# EAGLE design HyperDriver (EAGLE 9.2.0)
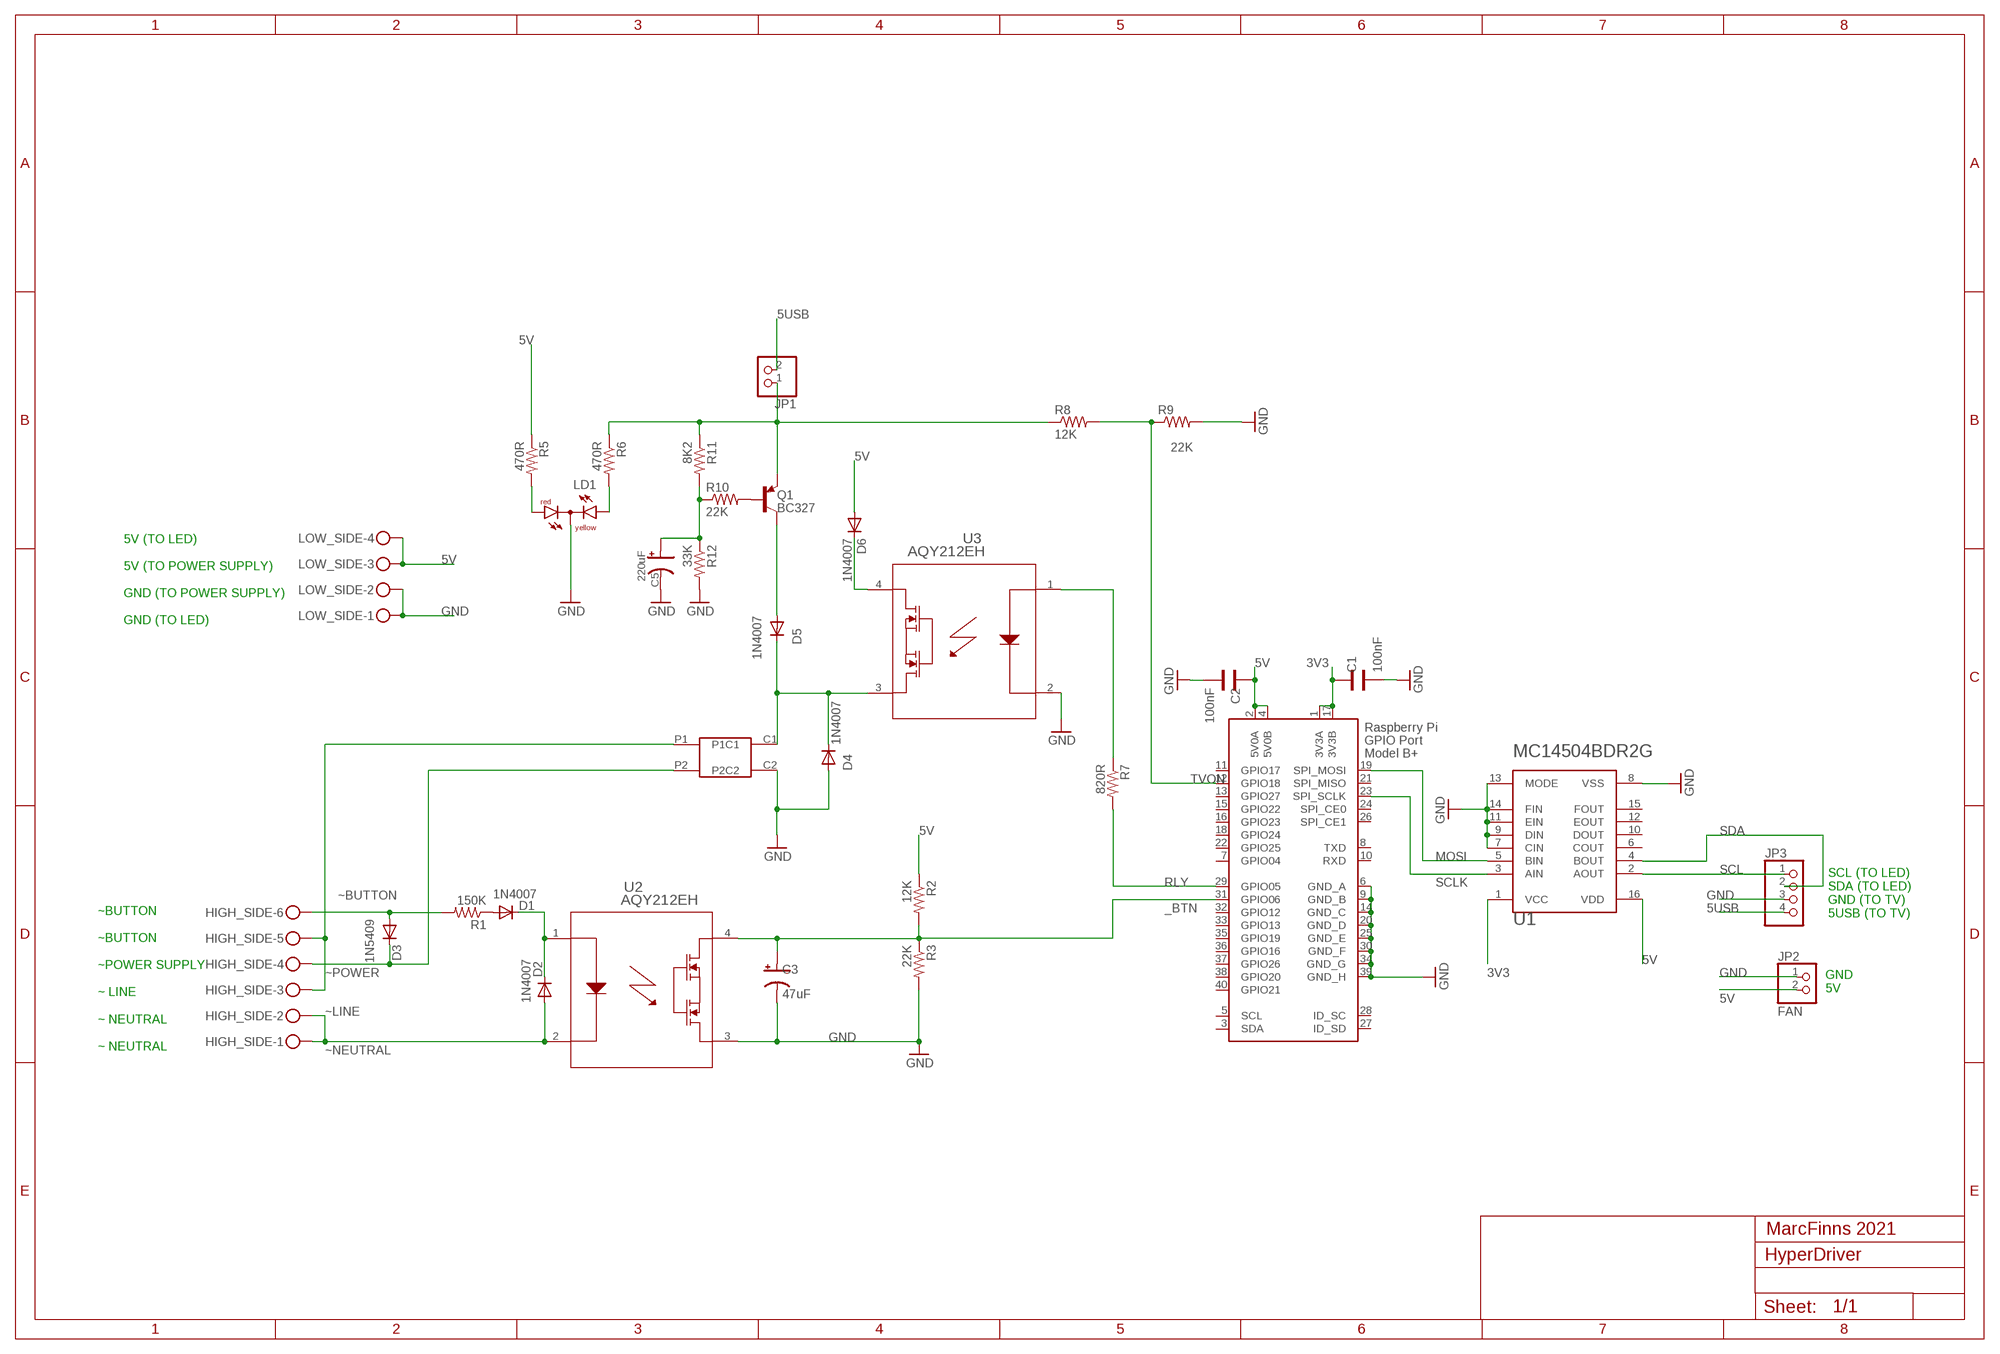
[diagram p0: schematic, sheet 1]

## Parts
C1  100nF  CAP055X070  [CAP-055X070]
C2  100nF  CAP055X070  [CAP-055X070]
C3  47uF  CAP-POL025X50  [CAP-POL-025X50]
C5  220uF  CAP-POLE3,5-8  [CAP-POL-E3,5-8]
D1  1N4007  1N4004  [DO41-10]
D2  1N4007  1N4004  [DO41-10]
D3  1N5409  1N5400  [DO201-15]
D4  1N4007  1N4004  [DO41-10]
D5  1N4007  1N4004  [DO41-10]
D6  1N4007  1N4004  [DO41-10]
G5NB_RELAY1  OMRON_G5NB_RELAY  [G5NB_RELAY]
HIGH_SIDE  MKDSN1,5/6-5,08  [MKDSN1,5/6-5,08]
JP1  PINHD-1X2  [1X02]
JP2  FAN  PINHD-1X2  [1X02]
JP3  PINHD-1X4  [1X04]
LD1  DUOLED-RY-C  [DUOLED-C-5MM]
LOW_SIDE  MKDSN1,5/4-5,08  [MKDSN1,5/4-5,08]
Q1  BC327  [TO92]
R1  150K  R-US_0207/9  [0207/9]
R2  12K  R-US_0207/9  [0207/9]
R3  22K  R-US_0207/9  [0207/9]
R5  470R  R-US_0207/9  [0207/9]
R6  470R  R-US_0207/9  [0207/9]
R7  820R  R-US_0207/9  [0207/9]
R8  12K  R-US_0207/9  [0207/9]
R9  22K  R-US_0207/9  [0207/9]
R10  22K  R-US_0207/9  [0207/9]
R11  8K2  R-US_0207/9  [0207/9]
R12  33K  R-US_0207/9  [0207/9]
U1  ON_SEMICONDUCTOR_MC14504BDR2GON_SEMICONDUCTOR_MC14504BDR2G_0_1  [ON_SEMICONDUCTOR_MC14504BDR2G_1]
U2  AQY212EH  [PAN_AQY21-DIP4_PAN]
U3  AQY212EH  [PAN_AQY21-DIP4_PAN]
X1  RASPI_GPIO_B+#_PIN  [RASPI_GPIO_B+_PIN]

## Nets
3V3: C1.1 U1.1(VCC) X1.1(3V3A) X1.17(3V3B)
5USB: JP1.2 JP3.4
5V: C2.1 D6.A JP2.2 LOW_SIDE.3 LOW_SIDE.4 R2.1 R5.1 U1.16(VDD) X1.2(5V0A) X1.4(5V0B)
_BTN: C3.A R2.2 R3.1 U2.4 X1.31(GPIO06)
GND: C1.2 C2.2 C3.C C5.C D4.A G5NB_RELAY1.C2 JP2.1 JP3.3 LD1.C LOW_SIDE.1 LOW_SIDE.2 R3.2 R9.2 R12.2 U1.7(CIN) U1.8(VSS) U1.9(DIN) U1.11(EIN) U1.13(MODE) U1.14(FIN) U2.3 U3.2 X1.6(GND_A) X1.9(GND_B) X1.14(GND_C) X1.20(GND_D) X1.25(GND_E) X1.30(GND_F) X1.34(GND_G) X1.39(GND_H)
J_5USB: JP1.1 Q1.1(E) R6.1 R8.1 R11.1
MOSI: U1.5(BIN) X1.19(SPI_MOSI)
N$1: LD1.AR R5.2
N$3: LD1.AX(AY) R6.2
N$4: D6.C U3.4
N$5: Q1.2(B) R10.2
N$6: C5.A R10.1 R11.2 R12.1
N$7: D1.C D2.C U2.1
N$8: R7.1 U3.1
N$9: D4.C D5.C G5NB_RELAY1.C1 U3.3
N$10: D5.A Q1.3(C)
N$11: D1.A R1.1
RLY: R7.2 X1.29(GPIO05)
SCL: JP3.1 U1.2(AOUT)
SCLK: U1.3(AIN) X1.23(SPI_SCLK)
SDA: JP3.2 U1.4(BOUT)
TVON: R8.2 R9.1 X1.12(GPIO18)
~BUTTON: D3.A HIGH_SIDE.6 R1.2
~LINE: G5NB_RELAY1.P1 HIGH_SIDE.3 HIGH_SIDE.5
~NEUTRAL: D2.A HIGH_SIDE.1 HIGH_SIDE.2 U2.2
~POWER: D3.C G5NB_RELAY1.P2 HIGH_SIDE.4
Unconnected: U1.6(COUT) U1.10(DOUT) U1.12(EOUT) U1.15(FOUT) X1.3(SDA) X1.5(SCL) X1.7(GPIO04) X1.8(TXD) X1.10(RXD) X1.11(GPIO17) X1.13(GPIO27) X1.15(GPIO22) X1.16(GPIO23) X1.18(GPIO24) X1.21(SPI_MISO) X1.22(GPIO25) X1.24(SPI_CE0) X1.26(SPI_CE1) X1.27(ID_SD) X1.28(ID_SC) X1.32(GPIO12) X1.33(GPIO13) X1.35(GPIO19) X1.36(GPIO16) X1.37(GPIO26) X1.38(GPIO20) X1.40(GPIO21)

## Notes on the sheet
- 5V (TO LED)
  
  5V (TO POWER SUPPLY)
  
  GND (TO POWER SUPPLY)
  
  GND (TO LED)
- SCL (TO LED)
  SDA (TO LED)
  GND (TO TV)
  5USB (TO TV)
- GND
  5V
- ~BUTTON
  
  ~BUTTON
  
  ~POWER SUPPLY
  
  ~ LINE
  
  ~ NEUTRAL
  
  ~ NEUTRAL
- MarcFinns 2021

## Library data of the parts
C1 C2 = Ai_Passives:CAP
C3 C5 = Ai_Passives:CAP-POL
D1 D2 D4-D6 = adafruit:1N4004: DIODE General purpose 1N400x type rectifier (With bigger pads) http://www.ladyada.net/library/pcb/eaglelibrary.html
D3 = diode:1N5400: DIODE standard rectifier, 3 A, 50 V (Motorola)
G5NB_RELAY1 = Omron G5NB Relay:OMRON_G5NB_RELAY
HIGH_SIDE = con-phoenix-508:MKDSN1,5/6-5,08: MKDSN 1,5/ 6-5,08 Printklemme Nennstrom: 13,5 A Nennspannung: 250 V Rastermaß: 5,08 mm Polzahl: 6 Anschlussart: Schraubanschluss Montage: Löten Anschlussrichtung Leiter/Platine: 0 ° Artikelnummer: 1729160 Source: http://eshop.phoenixcontact.com .. 1729160.pdf
JP1 JP2 = pinhead:PINHD-1X2: PIN HEADER
JP3 = pinhead:PINHD-1X4: PIN HEADER
LD1 = led:DUOLED-RY-C: DUO LED 2 colors (red/yellow), 5 mm, round, common Cathode www.ligitek.com or other producers.
LOW_SIDE = con-phoenix-508:MKDSN1,5/4-5,08: MKDSN 1,5/ 4-5,08 Printklemme Nennstrom: 13,5 A Nennspannung: 250 V Rastermaß: 5,08 mm Polzahl: 4 Anschlussart: Schraubanschluss Montage: Löten Anschlussrichtung Leiter/Platine: 0 ° Artikelnummer: 1729144 Source: http://eshop.phoenixcontact.com .. 1729144.pdf
Q1 = transistor-pnp:BC327: PNP Transistor
R1-R3 R5-R12 = adafruit:R-US_: RESISTOR, American symbol
U1 = ON Semiconductor - MC14504BDR2G:ON_SEMICONDUCTOR_MC14504BDR2G: Voltage Level Translator Unidirectional 1 Circuit 6 Channel 16-SOIC; AMBIENT_TEMPERATURE_RANGE_HIGH: +125°C; AMBIENT_TEMPERATURE_RANGE_LOW: -55°C; AUTOMOTIVE: No; CENTROID_NOT_SPECIFIED: No; DATASHEET: https://www.onsemi.com/pub/Collateral/MC14504B-D.PDF; DEVICE_CLASS_L1: Integrated Circuits (ICs); DEVICE_CLASS_L2: Logic ICs; DEVICE_CLASS_L3: Voltage Level Shifters; DIGIKEY_DESCRIPTION: IC TRNSLTR UNIDIRECTIONAL 16SOIC; DIGIKEY_PART_NUMBER: MC14504BDR2GOSCT-ND; FOOTPRINT_PARAMETERS_1: {"fp_type":"SOIC_narrow","params":{"N":{"nom":16,"long name":"Number of leads","min":null,"max":null,"short name":"N","type":"count"},"A":{"nom":false,"long name":"Height","min":1350000,"max":1750000,"short name":"A","type":"measurement"},"A1":{"nom":false,"long name":"Package clearance","min":100000,"max":250000,"short name":"A1","type":"measurement"},"A2":{"nom":false,"long name":"Package height","min":1100000,"max":1650000,"short name":"A2","type":"measurement"},"D":{"nom":false,"long name":"Package length","min":9800000,"max":10000000,"short name":"D","type":"measurement"},"E":{"nom":false,"long name":"Width w/ leads","min":5800000,"max":6200000,"short name":"E","type":"measurement"},"E1":{"nom":false,"long name":"Package width","min":3800000,"max":4000000,"short name":"E1","type":"measurement"},"B":{"nom":false,"long name":"Lead width","min":350000,"max":490000,"short name":"B","type":"measurement"},"C":{"nom":false,"long name":"Lead thickness","min":190000,"max":250000,"short name":"C","type":"measurement"},"e":{"nom":1270000,"long name":"Lead pitch","min":null,"max":null,"short name":"e","type":"measurement"},"L":{"nom":false,"long name":"Lead foot length","min":400000,"max":1250000,"short name":"L","type":"measurement"},"PHI":{"nom":false,"long name":"Lead foot angle","min":0,"max":7000000,"short name":"PHI","type":"measurement"},"HT":{"default":"No","long name":"Thermal pad","type":"multichoiceparent","short name":"HT","children":[]},"offset x":{"nom":0,"long name":"X Center offset","min":null,"max":null,"short name":"offset x","type":"measurement"},"offset y":{"nom":0,"long name":"Y Center offset","min":null,"max":null,"short name":"offset y","type":"measurement"},"LS":{"default":"Rounded rectangle","long name":"Land shape","type":"multichoice","short name":"LS"},"LS1":{"default":"Rectangle","long name":"Land shape (Pin 1)","type":"multichoice","short name":"LS1"},"solder toe":{"nom":550000,"long name":"Solder fillet (toe)","min":null,"max":null,"short name":"solder toe","type":"fixedmeasurement"},"solder heel":{"nom":450000,"long name":"Solder fillet (heel)","min":null,"max":null,"short name":"solder heel","type":"fixedmeasurement"},"solder side":{"nom":50000,"long name":"Solder fillet (side)","min":null,"max":null,"short name":"solder side","type":"fixedmeasurement"},"courtyard":{"nom":500000,"long name":"Courtyard","min":null,"max":null,"short name":"courtyard","type":"fixedmeasurement"},"SF":{"default":"A","long name":"Packing level","type":"multichoiceparent","short name":"SF","help":"http://support.upverter.com/customer/portal/articles/978783-what-is-a-footprint-packing-level","children":["solder toe","solder heel","solder side","courtyard"]}}}; FOOTPRINT_PARAMETERS_2: {"fp_type":"SOIC_narrow","params":{"N":{"nom":16,"long name":"Number of leads","min":null,"max":null,"short name":"N","type":"count"},"A":{"nom":false,"long name":"Height","min":1350000,"max":1750000,"short name":"A","type":"measurement"},"A1":{"nom":false,"long name":"Package clearance","min":100000,"max":250000,"short name":"A1","type":"measurement"},"A2":{"nom":false,"long name":"Package height","min":1100000,"max":1650000,"short name":"A2","type":"measurement"},"D":{"nom":false,"long name":"Package length","min":9800000,"max":10000000,"short name":"D","type":"measurement"},"E":{"nom":false,"long name":"Width w/ leads","min":5800000,"max":6200000,"short name":"E","type":"measurement"},"E1":{"nom":false,"long name":"Package width","min":3800000,"max":4000000,"short name":"E1","type":"measurement"},"B":{"nom":false,"long name":"Lead width","min":350000,"max":490000,"short name":"B","type":"measurement"},"C":{"nom":false,"long name":"Lead thickness","min":190000,"max":250000,"short name":"C","type":"measurement"},"e":{"nom":1270000,"long name":"Lead pitch","min":null,"max":null,"short name":"e","type":"measurement"},"L":{"nom":false,"long name":"Lead foot length","min":400000,"max":1250000,"short name":"L","type":"measurement"},"PHI":{"nom":false,"long name":"Lead foot angle","min":0,"max":7000000,"short name":"PHI","type":"measurement"},"HT":{"default":"No","long name":"Thermal pad","type":"multichoiceparent","short name":"HT","children":[]},"offset x":{"nom":0,"long name":"X Center offset","min":null,"max":null,"short name":"offset x","type":"measurement"},"offset y":{"nom":0,"long name":"Y Center offset","min":null,"max":null,"short name":"offset y","type":"measurement"},"LS":{"default":"Rounded rectangle","long name":"Land shape","type":"multichoice","short name":"LS"},"LS1":{"default":"Rectangle","long name":"Land shape (Pin 1)","type":"multichoice","short name":"LS1"},"solder toe":{"nom":350000,"long name":"Solder fillet (toe)","min":null,"max":null,"short name":"solder toe","type":"fixedmeasurement"},"solder heel":{"nom":350000,"long name":"Solder fillet (heel)","min":null,"max":null,"short name":"solder heel","type":"fixedmeasurement"},"solder side":{"nom":30000,"long name":"Solder fillet (side)","min":null,"max":null,"short name":"solder side","type":"fixedmeasurement"},"courtyard":{"nom":250000,"long name":"Courtyard","min":null,"max":null,"short name":"courtyard","type":"fixedmeasurement"},"SF":{"default":"B","long name":"Packing level","type":"multichoiceparent","short name":"SF","help":"http://support.upverter.com/customer/portal/articles/978783-what-is-a-footprint-packing-level","children":["solder toe","solder heel","solder side","courtyard"]}}}; FOOTPRINT_PARAMETERS_3: {"fp_type":"SOIC_narrow","params":{"N":{"nom":16,"long name":"Number of leads","min":null,"max":null,"short name":"N","type":"count"},"A":{"nom":false,"long name":"Height","min":1350000,"max":1750000,"short name":"A","type":"measurement"},"A1":{"nom":false,"long name":"Package clearance","min":100000,"max":250000,"short name":"A1","type":"measurement"},"A2":{"nom":false,"long name":"Package height","min":1100000,"max":1650000,"short name":"A2","type":"measurement"},"D":{"nom":false,"long name":"Package length","min":9800000,"max":10000000,"short name":"D","type":"measurement"},"E":{"nom":false,"long name":"Width w/ leads","min":5800000,"max":6200000,"short name":"E","type":"measurement"},"E1":{"nom":false,"long name":"Package width","min":3800000,"max":4000000,"short name":"E1","type":"measurement"},"B":{"nom":false,"long name":"Lead width","min":350000,"max":490000,"short name":"B","type":"measurement"},"C":{"nom":false,"long name":"Lead thickness","min":190000,"max":250000,"short name":"C","type":"measurement"},"e":{"nom":1270000,"long name":"Lead pitch","min":null,"max":null,"short name":"e","type":"measurement"},"L":{"nom":false,"long name":"Lead foot length","min":400000,"max":1250000,"short name":"L","type":"measurement"},"PHI":{"nom":false,"long name":"Lead foot angle","min":0,"max":7000000,"short name":"PHI","type":"measurement"},"HT":{"default":"No","long name":"Thermal pad","type":"multichoiceparent","short name":"HT","children":[]},"offset x":{"nom":0,"long name":"X Center offset","min":null,"max":null,"short name":"offset x","type":"measurement"},"offset y":{"nom":0,"long name":"Y Center offset","min":null,"max":null,"short name":"offset y","type":"measurement"},"LS":{"default":"Rounded rectangle","long name":"Land shape","type":"multichoice","short name":"LS"},"LS1":{"default":"Rectangle","long name":"Land shape (Pin 1)","type":"multichoice","short name":"LS1"},"solder toe":{"nom":150000,"long name":"Solder fillet (toe)","min":null,"max":null,"short name":"solder toe","type":"fixedmeasurement"},"solder heel":{"nom":250000,"long name":"Solder fillet (heel)","min":null,"max":null,"short name":"solder heel","type":"fixedmeasurement"},"solder side":{"nom":10000,"long name":"Solder fillet (side)","min":null,"max":null,"short name":"solder side","type":"fixedmeasurement"},"courtyard":{"nom":100000,"long name":"Courtyard","min":null,"max":null,"short name":"courtyard","type":"fixedmeasurement"},"SF":{"default":"C","long name":"Packing level","type":"multichoiceparent","short name":"SF","help":"http://support.upverter.com/customer/portal/articles/978783-what-is-a-footprint-packing-level","children":["solder toe","solder heel","solder side","courtyard"]}}}; FOOTPRINT_URL: https://www.onsemi.com/pub/Collateral/751B-05.PDF; FOOTPRINT_VARIANT_NAME_0: Recommended_Land_Pattern; FOOTPRINT_VARIANT_NAME_1: IPC_A; FOOTPRINT_VARIANT_NAME_2: IPC_B; FOOTPRINT_VARIANT_NAME_3: IPC_C; HEIGHT: 1.75mm; IPC_LAND_PATTERN_NAME: SOIC127P600X155-16; LEAD_FREE: Yes; LOGIC_FUNCTION_DESC: Non-Inverting; MAX_SUPPLY_VOLTAGE: 18V; MF: ON Semiconductor; MFG_PACKAGE_IDENT: 751B-05; MFG_PACKAGE_IDENT_DATE: 12/2006; MFG_PACKAGE_IDENT_REV: K; MIN_SUPPLY_VOLTAGE: 3V; MOUSER_DESCRIPTION: Voltage Level Shifter CMOS/TTL to CMOS 6 Unidirectional Automotive 16-Pin SOIC T/R; MOUSER_PART_NUMBER: 863-MC14504BDR2G; MPN: MC14504BDR2G; NUMBER_OF_CIRCUITS: 6; NUMBER_OF_INPUTS: 1; NUMBER_OF_OUTPUTS: 1; NUM_PINS: 16; OCTOPART_PART_NUMBER: a116681b6feb7ed1; PACKAGE: SOIC16; PREFIX: U; PROPAGATION_DELAY: 175ns; QUIESCENT_CURRENT: 0.0005-2500uA; ROHS: Yes; STANDOFF_HEIGHT: 0.25mm; SYMBOL_0_0: Standard; TYPE: integrated circuit; VERIFICATION_VERSION: 0.0.0.3; V_A_MAX: 18V; V_A_MIN: 3V; V_B_MAX: 18V; V_B_MIN: 3V
U2 U3 = AQY21-DIP:AQY212EH; BUILT_BY: EMA_UL_Team; MANUFACTURER_PART_NUMBER: AQY212EH; SOURCELIBRARY: Panasonic_2014-11-06; VENDOR: Panasonic
X1 = raspberrypi_bastelstube_v13:RASPI_GPIO_B+#: 2x20 header connector, all pins connected

## Net classes
1 power: width 0.61 mm
2 hipower: width 0.813 mm

## Board
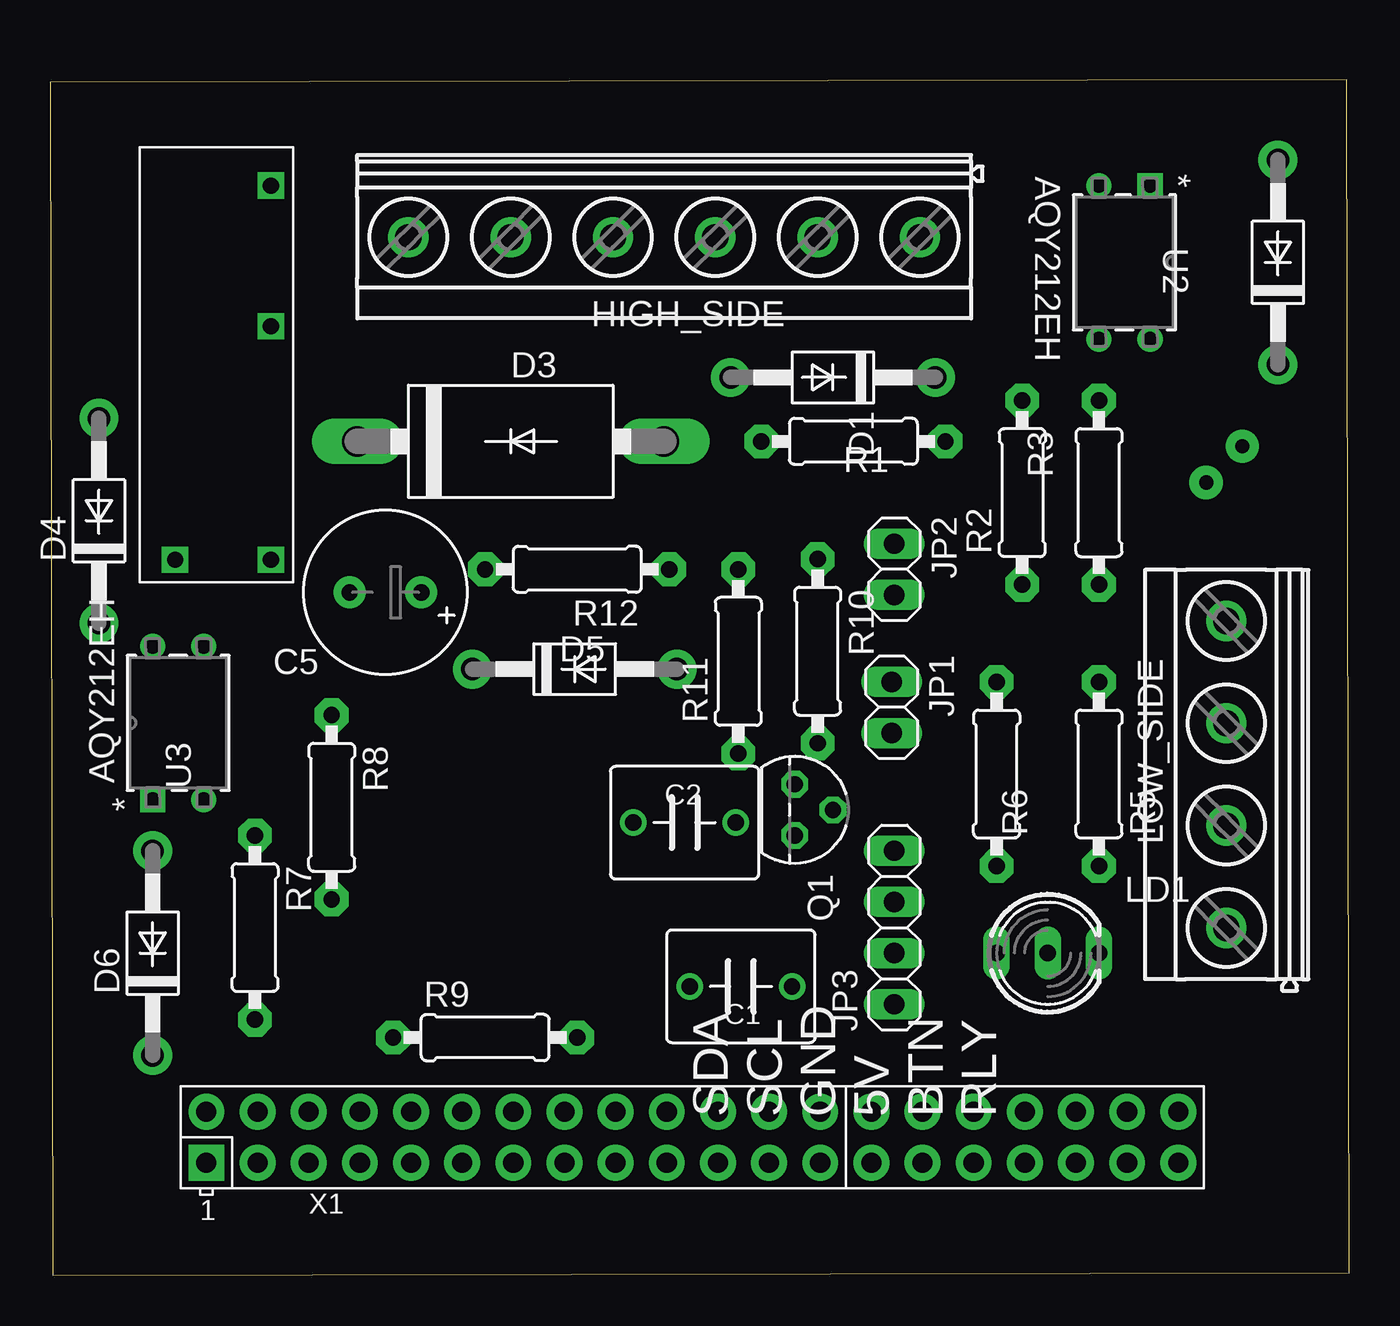
[diagram p1: board, top side]
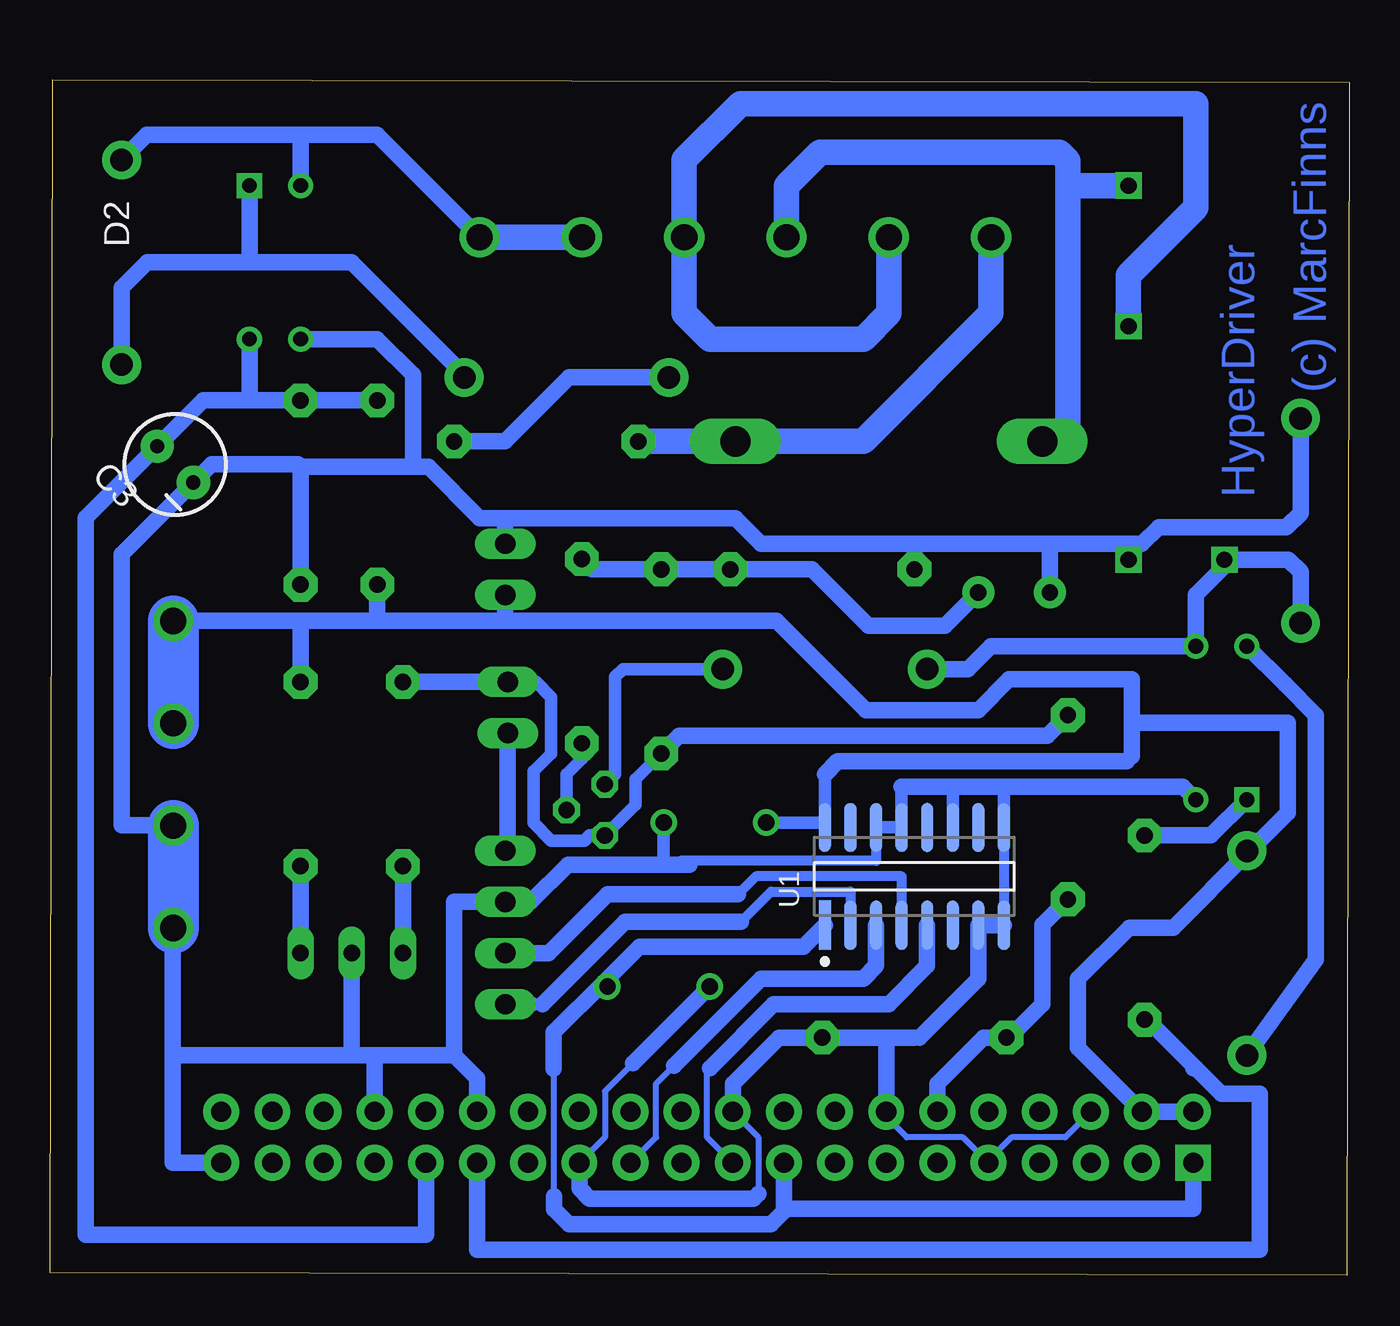
[diagram p2: board, bottom side, seen from below]

Size 64.5 x 59.36 mm. Coordinates in mm from the lower left corner, seen from the top.
Outline: 0.13,0 64.5,0.13 64.37,59.36 0,59.23 0.13,0
Copper layers (1*16): Top 0.035mm / dielectric 1.5mm / Bottom 0.035mm
Design rules "default": minimum track width 6mil, minimum drill 0.35mm, track to track 6mil, track to pad 6mil, pad to pad 6mil, via to via 6mil, smd to smd 6mil, copper to edge 40mil, drill to drill 6mil, minimum pad ring 10mil, minimum via ring 8mil, stop-mask expansion 4mil, vias tented up to drill 0mil, thermal gap 10mil

### Footprints (pad centres in the part's own frame; a part is rotated, then mirrored left to right if it is on the bottom)
CAP-055X070 = drill 0.813: 1 -2.54,0; 2 2.54,0
CAP-POL-025X50 = drill 0.7 pad 1.651: A 1.27,0; C -1.27,0
CAP-POL-E3,5-8 = drill 0.813 pad 1.6: A -1.778,0; C 1.778,0
DO41-10 = drill 1.118 pad 1.93: A 5.08,0; C -5.08,0
DO201-15 = drill 1.499 long: A 7.62,0; C -7.62,0
G5NB_RELAY = drill 0.8 square: C1 1.111,5.874; C2 1.111,1.111; P1 12.7,1.111; P2 19.685,1.111
MKDSN1,5/6-5,08 = drill 1.3 pad 2: 1 -12.7,0.025; 2 -7.62,0.025; 3 -2.54,0.025; 4 2.54,0.025; 5 7.62,0.025; 6 12.7,0.025
1X02 = drill 1.016 long: 1 -1.27,0; 2 1.27,0
1X04 = drill 1.016 long: 1 -3.81,0; 2 -1.27,0; 3 1.27,0; 4 3.81,0
DUOLED-C-5MM = drill 0.813 long: AR 2.54,0; AX -2.54,0; C 0,0
MKDSN1,5/4-5,08 = drill 1.3 pad 2: 1 -7.641,0.025; 2 -2.561,0.025; 3 2.519,0.025; 4 7.599,0.025
TO92 = drill 0.813 octagon: 1 1.27,0; 2 0,1.905; 3 -1.27,0
0207/9 = drill 0.813 pad 1.676 octagon: 1 -4.572,0; 2 4.572,0
ON_SEMICONDUCTOR_MC14504BDR2G_1 = smd 2.454 x 0.607: 1 -2.426,4.445; 2 -2.426,3.175; 3 -2.426,1.905; 4 -2.426,0.635; 5 -2.426,-0.635; 6 -2.426,-1.905; 7 -2.426,-3.175; 8 -2.426,-4.445; 9 2.426,-4.445; 10 2.426,-3.175; 11 2.426,-1.905; 12 2.426,-0.635; 13 2.426,0.635; 14 2.426,1.905; 15 2.426,3.175; 16 2.426,4.445
PAN_AQY21-DIP4_PAN = drill 0.737 pad 1.245 square: 1 0,0 | drill 0.737 pad 1.245: 2 0,-2.54; 3 7.62,-2.54; 4 7.62,0
RASPI_GPIO_B+_PIN = drill 1 pad 1.778 square: 1 -24.13,-1.27 | drill 1 pad 1.778: 2 -24.13,1.27; 3 -21.59,-1.27; 4 -21.59,1.27; 5 -19.05,-1.27; 6 -19.05,1.27; 7 -16.51,-1.27; 8 -16.51,1.27; 9 -13.97,-1.27; 10 -13.97,1.27; 11 -11.43,-1.27; 12 -11.43,1.27; 13 -8.89,-1.27; 14 -8.89,1.27; 15 -6.35,-1.27; 16 -6.35,1.27; 17 -3.81,-1.27; 18 -3.81,1.27; 19 -1.27,-1.27; 20 -1.27,1.27; 21 1.27,-1.27; 22 1.27,1.27; 23 3.81,-1.27; 24 3.81,1.27; 25 6.35,-1.27; 26 6.35,1.27; 27 8.89,-1.27; 28 8.89,1.27; 29 11.43,-1.27; 30 11.43,1.27; 31 13.97,-1.27; 32 13.97,1.27; 33 16.51,-1.27; 34 16.51,1.27; 35 19.05,-1.27; 36 19.05,1.27; 37 21.59,-1.27; 38 21.59,1.27; 39 24.13,-1.27; 40 24.13,1.27

### Placement (x,y rotation side)
C1  34.29,14.35 180 top
C2  31.5,22.48 0 top
C3  10uF  [CAP-POL-025X50]  58.29,40.26 135 bottom
C5  16.64,33.91 180 top
D1  38.86,44.58 180 top
D2  60.96,50.29 90 top
D3  22.86,41.4 0 top
D4  2.41,37.46 90 top
D5  26.04,30.1 0 top
D6  5.08,16 90 top
G5NB_RELAY1  12.06,34.42 90 top
HIGH_SIDE  30.48,51.56 180 top
JP1  41.78,28.19 270 top
JP2  41.91,35.05 270 top
JP3  41.91,17.27 90 top
LD1  49.53,16 0 top
LOW_SIDE  58.42,24.89 90 top
Q1  36.96,23.11 270 top
R1  39.88,41.4 180 top
R2  48.26,38.86 90 top
R3  52.07,38.86 270 top
R5  52.07,24.89 270 top
R6  46.99,24.89 270 top
R7  10.16,17.27 270 top
R8  13.97,23.24 270 top
R9  21.59,11.81 0 top
R10  38.1,30.99 270 top
R11  34.16,30.48 90 top
R12  26.16,35.05 180 top
U1  21.59,19.81 90 bottom
U2  54.61,54.1 270 top
U3  5.08,23.62 90 top
X1  31.88,6.86 0 top

### Tracks (layer width: path | path; a pad name or v marks a point on that pad's centre or on a via)
3V3
  Bottom 0.152: 26.53,16.89 U1.1 | 39.5,3.94 39.49,3.93 | C1.1 36.88,14.43 37.01,14.55
  Bottom 0.305: 39.61,10.15 39.5,10.26 39.5,3.94
  Bottom 0.813: 28.07,3.17 27.94,3.3 7.75,3.3 X1.1 | U1.1 27.1,16.32 35.24,16.32 37.01,14.55 39.5,12.07 39.5,10.26 | X1.17 28.07,3.17 | 39.49,3.93 39.49,3.29 38.73,2.54 28.7,2.54 28.07,3.17
5USB
  Bottom 0.813: JP1.2 41.78,21.21 JP3.4
5V
  Bottom 0.152: D6.A 5,21.01 | 10.79,27.43 10.79,27.56 | 11.05,25.53 10.79,25.78 | 26.16,22.48 26.04,22.61
  Bottom 0.61: 26.04,24.89 26.04,22.61 U1.16 | C2.1 26.16,22.48
  Bottom 0.813: X1.2 X1.4 13.46,11.3 13.46,14.73 10.92,17.27 8.74,17.27 5,21.01 3.05,22.96 3.05,27.43 10.79,27.43 10.79,25.78 | LOW_SIDE.4 52.07,32.49 | 52.07,32.49 48.26,32.49 | R2.1 48.26,32.49 | 48.26,32.49 41.91,32.49 | 26.04,24.89 25.4,25.53 11.05,25.53 | 41.91,32.49 28.43,32.49 24,28.07 18.41,28.07 16.89,29.59 10.79,29.59 10.79,27.56 | JP2.2 41.91,32.49 | 52.07,32.49 R5.1
  Bottom 2.54: LOW_SIDE.4 LOW_SIDE.3
_BTN
  Bottom 0.152: 62.74,37.61 62.74,37.59
  Bottom 0.813: X1.31 45.85,2.03 62.74,2.03 62.74,37.59 | R2.2 R3.1 54.61,43.43 | U2.4 54.61,43.43 | 54.61,43.43 56.52,43.43 56.91,43.43 C3.A 62.74,37.61
GND
  Bottom 0.152: U1.7 18.41,15.79 | LOW_SIDE.2 58.42,22.35 | 58.42,17.23 LOW_SIDE.1 | 52.07,40.13 52.2,40.26 | 33.21,20.57 33.4,20.38 | 21.34,11.81 21.59,11.81 | 17.91,5.71 X1.9 | 22.99,7.87 X1.14 | 14.86,36.2 14.99,36.32 | 10.95,35.85 11.43,36.32
  Bottom 0.305: X1.6 14.1,6.86 16.76,6.86 17.91,5.71 | X1.9 19.18,6.86 21.97,6.86 22.99,7.87 | X1.20 29.34,6.86 29.34,4.06 | 35.56,10.54 36.96,9.14 36.96,6.86 X1.25
  Bottom 0.508: U1.9 U1.8 | U1.14 23.5,20.57 33.21,20.57
  Bottom 0.61: 17.14,24.26 U1.9 | 19.68,24.26 U1.11 | 22.23,24.26 U1.13 U1.14 | C2.2 34.04,20.38
  Bottom 0.813: 58.42,10.92 58.42,5.59 X1.39 | 44.45,10.92 44.45,18.54 JP3.3 40.64,18.54 38.8,20.38 34.04,20.38 33.4,20.38 32.77,20.38 | X1.25 38.23,4.32 37.72,3.81 29.59,3.81 29.34,4.06 | X1.20 30.61,9.52 28.32,11.81 R9.2 22.99,11.81 | U3.2 8.26,24.26 17.14,24.26 19.68,24.26 22.23,24.26 | 21.59,11.81 22.99,11.81 | 48.39,10.92 44.45,10.92 | 58.42,10.92 49.53,10.92 | 49.53,10.92 48.39,10.92 | 48.39,10.92 X1.34 | U1.8 U1.7 18.41,14.73 21.34,11.81 | 58.42,17.23 58.42,10.92 | 22.99,11.81 X1.14 | 58.42,22.35 60.96,22.35 60.96,35.8 C3.C 56.5,40.26 52.2,40.26 | 46.48,40.13 52.07,40.13 R3.2 | 46.48,40.13 45.72,40.13 43.18,37.59 41.91,37.59 | 46.48,40.13 46.48,44.7 48.26,46.48 U2.3 | D4.A 2.41,37.85 3.11,37.15 9.46,37.15 10.29,36.32 11.43,36.32 14.99,36.32 21.59,36.32 | LD1.C 49.53,10.92 | C5.C 14.86,36.2 | 21.59,36.32 29.21,36.32 30.48,37.59 41.91,37.59 | R12.2 21.59,36.32 | C1.2 35.56,10.54 | X1.30 43.31,9.78 44.45,10.92 | JP2.1 41.91,37.59 | G5NB_RELAY1.C2 10.95,35.85
  Bottom 2.54: LOW_SIDE.2 LOW_SIDE.1
J_5USB
  Bottom 0.152: 42.06,29.46 42.06,29.52 JP1.1
  Bottom 0.61: JP1.1 40.39,29.46 39.62,28.7 39.62,25.91 40.51,25.02 40.51,22.48 39.62,21.59 37.97,21.59 37.72,21.84 Q1.1 35.43,23.37 35.43,24.64 R11.1
  Bottom 0.813: R8.1 14.99,26.8 33.27,26.8 R11.1 | 41.91,29.46 42.06,29.46 R6.1
MOSI
  Bottom 0.152: 31.88,10.16 31.75,10.29
  Bottom 0.305: X1.19 31.88,6.86 31.88,10.16
  Bottom 0.813: U1.5 20.95,15.37 22.86,13.46 28.57,13.46 31.75,10.29
N$1
  Bottom 0.813: R5.2 LD1.AR
N$3
  Bottom 0.813: R6.2 LD1.AX
N$4
  Bottom 0.813: D6.C 1.65,15.68 1.65,27.81 3.17,29.34 U3.4
N$5
  Bottom 0.61: R10.2 38.1,25.65 38.86,24.89 Q1.2
N$6
  Bottom 0.813: R10.1 37.59,35.05 R11.2 R12.1 26.67,35.05 23.88,32.26 20.07,32.26 C5.A
N$7
  Bottom 0.813: U2.1 54.61,50.29 | D1.C 43.94,44.7 49.53,50.29 54.61,50.29 | 54.61,50.29 59.69,50.29 60.96,49.02 D2.C
N$8
  Bottom 0.813: U3.1 6.86,21.84 R7.1
N$9
  Bottom 0.152: G5NB_RELAY1.C1 6.19,35.21
  Bottom 0.813: 6.19,35.21 7.62,33.78 U3.3 17.78,31.24 18.92,30.1 D5.C | G5NB_RELAY1.C1 3.02,35.53 2.41,34.92 D4.C
N$10
  Bottom 0.61: D5.A 36.07,30.1 36.45,29.72 36.45,24.89 Q1.3
N$11
  Bottom 0.813: D1.A 38.73,44.58 41.91,41.4 R1.1
RLY
  Bottom 0.152: 10.03,12.7 R7.2
  Bottom 0.813: X1.29 43.31,1.27 4.45,1.27 4.45,9.02 6.35,9.02 7.62,10.29 | 7.75,10.29 7.62,10.29 | 7.62,10.29 10.03,12.7
SCL
  Bottom 0.152: 40.06,13.46 40.64,13.46
  Bottom 0.508: 30.2,17.55 28.7,19.05 24.77,19.05 U1.2
  Bottom 0.813: 40.64,13.46 JP3.1 | 30.2,17.55 35.97,17.55 40.06,13.46
SCLK
  Bottom 0.305: X1.23 34.42,6.86 34.42,9.52 33.53,10.41
  Bottom 0.813: 33.53,10.41 29.21,14.73 24.13,14.73 23.5,15.37 U1.3
SDA
  Bottom 0.152: 22.35,17.51 U1.4
  Bottom 0.508: U1.4 22.23,19.81 29.46,19.81 30.35,18.92
  Bottom 0.813: JP3.2 39.75,16 36.83,18.92 30.35,18.92
TVON
  Bottom 0.152: 16.89,11.81 R9.1 17.07,11.68 17.04,11.66
  Bottom 0.61: 17.04,11.66 17.02,11.68
  Bottom 0.813: X1.12 20.45,9.52 18.16,11.81 R9.1 | R8.2 15.24,17.4 15.24,13.46 16.89,11.81
~BUTTON
  Bottom 1.27: R1.2 D3.A 24.13,41.4 17.78,47.75 HIGH_SIDE.6
~LINE
  Bottom 1.27: 22.89,51.56 HIGH_SIDE.5 22.86,47.75 24.13,46.48 31.75,46.48 33.02,47.75 HIGH_SIDE.3 33.02,55.37 30.23,58.17 7.62,58.17 7.62,52.99 10.95,49.66 G5NB_RELAY1.P1
~NEUTRAL
  Bottom 0.813: HIGH_SIDE.1 48.27,56.63 52.07,56.63 | D2.A 59.7,56.63 52.07,56.63 | 52.07,56.63 U2.2
  Bottom 1.27: HIGH_SIDE.1 HIGH_SIDE.2
~POWER
  Bottom 0.152: 13.97,41.4 D3.C
  Bottom 1.27: HIGH_SIDE.4 27.94,54.1 26.29,55.75 14.38,55.75 13.97,55.34 13.97,54.1 | G5NB_RELAY1.P2 13.97,54.1 | 13.97,54.1 13.97,41.4

### Text on the board
Bottom: (c) MarcFinns | HyperDriver
tNames: SDA / SCL / GND / 5V / BTN / RLY